# EAGLE design Comportamiento central (EAGLE 9.6.2)
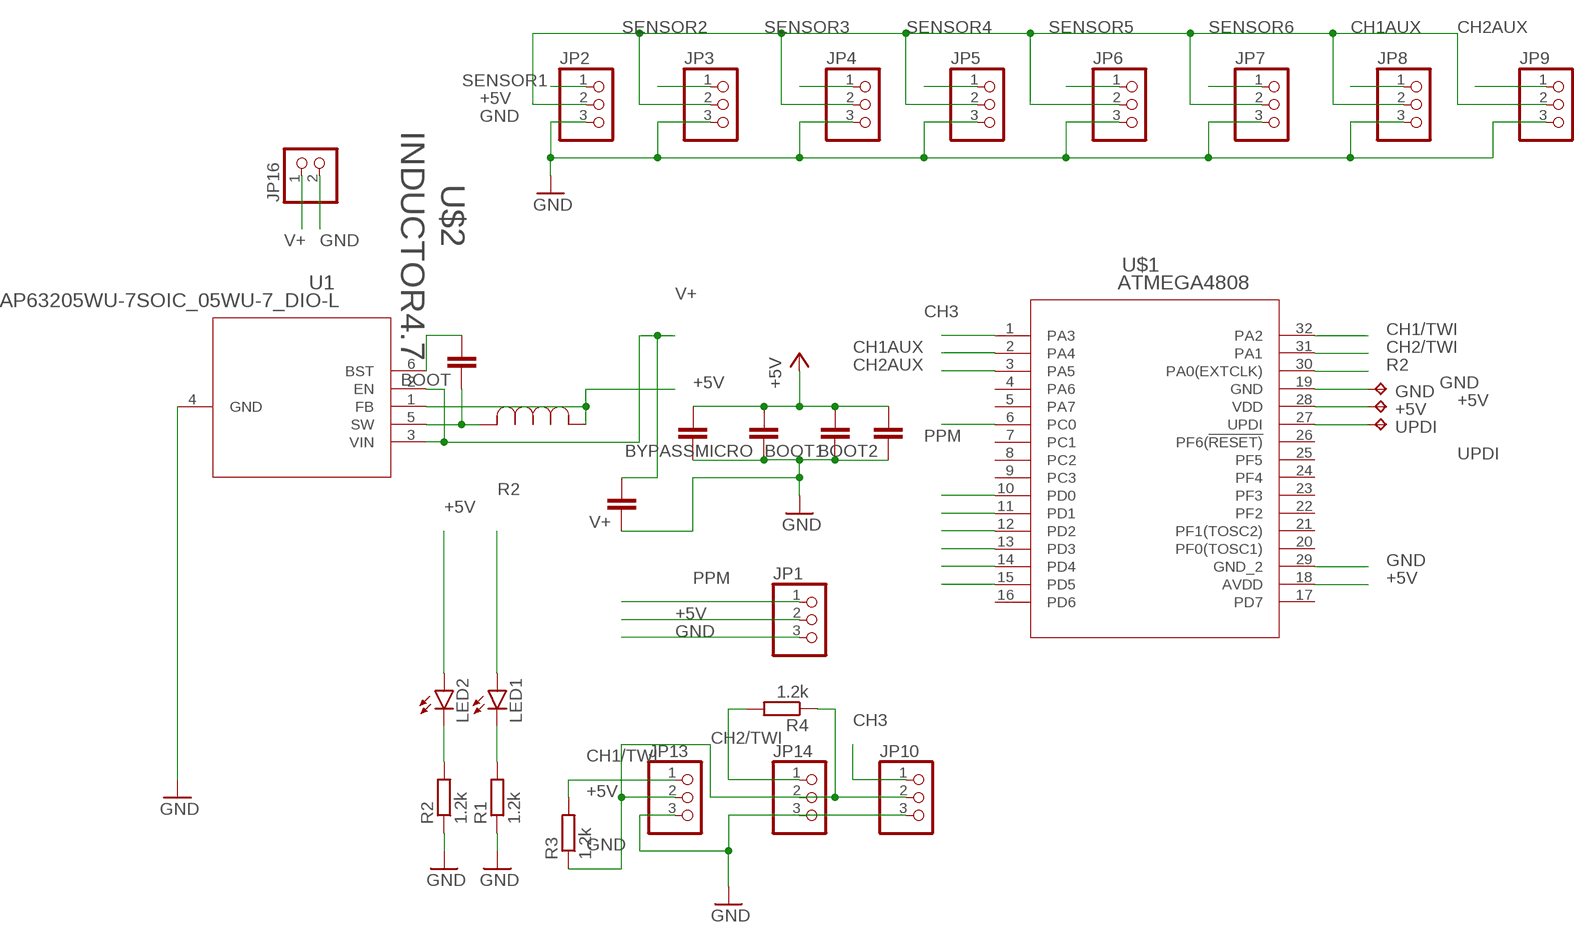
[diagram p0: schematic, sheet 1]

## Parts
+5V  TPB1,27  [B1,27]
BOOT  C-EUC0402  [C0402]
BOOT1  C-EUC0402  [C0402]
BOOT2  C-EUC0402  [C0402]
BYPASSMICRO  C-EUC0603  [C0603]
BYPASSMICRO2  C-EUC0603  [C0603]
GND  TPB1,27  [B1,27]
JP1  PINHD-1X03_2.54-S  [1X03-S]
JP2  PINHD-1X03_2.54-S  [1X03-S]
JP3  PINHD-1X03_2.54-S  [1X03-S]
JP4  PINHD-1X03_2.54-S  [1X03-S]
JP5  PINHD-1X03_2.54-S  [1X03-S]
JP6  PINHD-1X03_2.54-S  [1X03-S]
JP7  PINHD-1X03_2.54-S  [1X03-S]
JP8  PINHD-1X03_2.54-S  [1X03-S]
JP9  PINHD-1X03_2.54-S  [1X03-S]
JP10  PINHD-1X03_2.54-S  [1X03-S]
JP13  PINHD-1X03_2.54-S  [1X03-S]
JP14  PINHD-1X03_2.54-S  [1X03-S]
JP16  PINHD-1X02_2.54-S  [1X02-S]
LED1  LEDCHIPLED_0603  [CHIPLED_0603]
LED2  LEDCHIPLED_0603  [CHIPLED_0603]
R1  1.2k  R-EU_R0603  [R0603]
R2  1.2k  R-EU_R0603  [R0603]
R3  1.2k  R-EU_R0603  [R0603]
R4  1.2k  R-EU_R0603  [R0603]
U1  AP63205WU-7SOIC_05WU-7_DIO-L  [SOIC_05WU-7_DIO-L]
U$1  ATMEGA4808  [QFP80P900X900X120-32N]
U$2  INDUCTOR4.7  [IND_NRS5030T100MMGJ_TAY]
UPDI  TPB1,27  [B1,27]
V+  C-EUC1206  [C1206]

## Nets
+5V: +5V.TP BOOT1.2 BOOT2.2 BYPASSMICRO2.2 BYPASSMICRO.2 JP1.2 JP2.2 JP3.2 JP4.2 JP5.2 JP6.2 JP7.2 JP8.2 JP9.2 JP10.2 JP13.2 JP14.2 LED2.A R3.1 R4.1 U1.1(FB) U$1.18(AVDD) U$1.28(VDD) U$2.1
CH1/TWI: JP13.1 R3.2 U$1.32(PA2)
CH1AUX: JP8.1 U$1.2(PA4)
CH2/TWI: JP14.1 R4.2 U$1.31(PA1)
CH2AUX: JP9.1 U$1.3(PA5)
CH3: JP10.1 U$1.1(PA3)
GND: BOOT1.1 BOOT2.1 BYPASSMICRO2.1 BYPASSMICRO.1 GND.TP JP1.3 JP2.3 JP3.3 JP4.3 JP5.3 JP6.3 JP7.3 JP8.3 JP9.3 JP10.3 JP13.3 JP14.3 JP16.2 R1.1 R2.1 U1.4(GND) U$1.19(GND) U$1.29(GND_2) V+.1
N$2: LED2.C R2.2
N$15: LED1.C R1.2
N$17: BOOT.1 U1.5(SW) U$2.2
N$18: BOOT.2 U1.6(BST)
PPM: JP1.1 U$1.6(PC0)
R2: LED1.A U$1.30(PA0(EXTCLK))
SENSOR1: JP2.1 U$1.10(PD0)
SENSOR2: JP3.1 U$1.11(PD1)
SENSOR3: JP4.1 U$1.12(PD2)
SENSOR4: JP5.1 U$1.13(PD3)
SENSOR5: JP6.1 U$1.14(PD4)
SENSOR6: JP7.1 U$1.15(PD5)
UPDI: U$1.27(UPDI) UPDI.TP
V+: JP16.1 U1.2(EN) U1.3(VIN) V+.2
Unconnected: U$1.4(PA6) U$1.5(PA7) U$1.7(PC1) U$1.8(PC2) U$1.9(PC3) U$1.16(PD6) U$1.17(PD7) U$1.20(PF0(TOSC1)) U$1.21(PF1(TOSC2)) U$1.22(PF2) U$1.23(PF3) U$1.24(PF4) U$1.25(PF5) U$1.26(PF6(!RESET))

## Library data of the parts
+5V GND UPDI = testpad:TP: Test pad
BOOT BOOT1 BOOT2 BYPASSMICRO BYPASSMICRO2 V+ = rcl:C-EU: CAPACITOR, European symbol; SPICEPREFIX: C
JP1-JP10 JP13 JP14 = pinhead-2:PINHD-1X03: PIN HEADER
JP16 = pinhead-2:PINHD-1X02: PIN HEADER
LED1 LED2 = led:LED: LED OSRAM: - CHIPLED LG R971, LG N971, LY N971, LG Q971, LY Q971, LO R971, LY R971 LH N974, LH R974 LS Q976, LO Q976, LY Q976 LO Q996 - Hyper CHIPLED LW Q18S LB Q993, LB Q99A, LB R99A - SideLED LS A670, LO A670, LY A670, LG A670, LP A670 LB A673, LV A673, LT A673, LW A673 LH A674 LY A675 LS A676, LA A676, LO A676, LY A676, LW A676 LS A679, LY A679, LG A679 - Hyper Micro SIDELED® LS Y876, LA Y876, LO Y876, LY Y876 LT Y87S - SmartLED LW L88C, LW L88S LB L89C, LB L89S, LG L890 LS L89K, LO L89K, LY L89K LS L896, LA L896, LO L896, LY L896 - TOPLED LS T670, LO T670, LY T670, LG T670, LP T670 LSG T670, LSP T670, LSY T670, LOP T670, LYG T670 LG T671, LOG T671, LSG T671 LB T673, LV T673, LT T673, LW T673 LH T674 LS T676, LA T676, LO T676, LY T676, LB T676, LH T676, LSB T676, LW T676 LB T67C, LV T67C, LT T67C, LS T67K, LO T67K, LY T67K, LW E67C LS E67B, LA E67B, LO E67B, LY E67B, LB E67C, LV E67C, LT E67C LW T67C LS T679, LY T679, LG T679 LS T770, LO T770, LY T770, LG T770, LP T770 LB T773, LV T773, LT T773, LW T773 LH T774 LS E675, LA E675, LY E675, LS T675 LS T776, LA T776, LO T776, LY T776, LB T776 LHGB T686 LT T68C, LB T68C - Hyper Mini TOPLED® LB M676 - Mini TOPLED Santana® LG M470 LS M47K, LO M47K, LY M47K Source: http://www.osram.convergy.de LUXEON: - LUMILED® LXK2-PW12-R00, LXK2-PW12-S00, LXK2-PW14-U00, LXK2-PW14-V00 LXK2-PM12-R00, LXK2-PM12-S00, LXK2-PM14-U00 LXK2-PE12-Q00, LXK2-PE12-R00, LXK2-PE12-S00, LXK2-PE14-T00, LXK2-PE14-U00 LXK2-PB12-K00, LXK2-PB12-L00, LXK2-PB12-M00, LXK2-PB14-N00, LXK2-PB14-P00, LXK2-PB14-Q00 LXK2-PR12-L00, LXK2-PR12-M00, LXK2-PR14-Q00, LXK2-PR14-R00 LXK2-PD12-Q00, LXK2-PD12-R00, LXK2-PD12-S00 LXK2-PH12-R00, LXK2-PH12-S00 LXK2-PL12-P00, LXK2-PL12-Q00, LXK2-PL12-R00 Source: www.luxeon.com KINGBRIGHT: KA-3528ASYC Source: www.kingbright.com
R1-R4 = rcl:R-EU_: RESISTOR, European symbol; SPICEPREFIX: R
U1 = AP63205WU-7:AP63205WU-7; BUILT_BY: EMA_Matt; COPYRIGHT: Copyright (C) 2018 Accelerated Designs. All rights reserved; MANUFACTURER_PART_NUMBER: AP63205WU-7; SOURCELIBRARY: Diodes_Inc_2019-12-05; VENDOR: Diodes Inc
U$1 = Atmega4808:ATMEGA4808
U$2 = Inductor4.7:INDUCTOR4.7

## Board
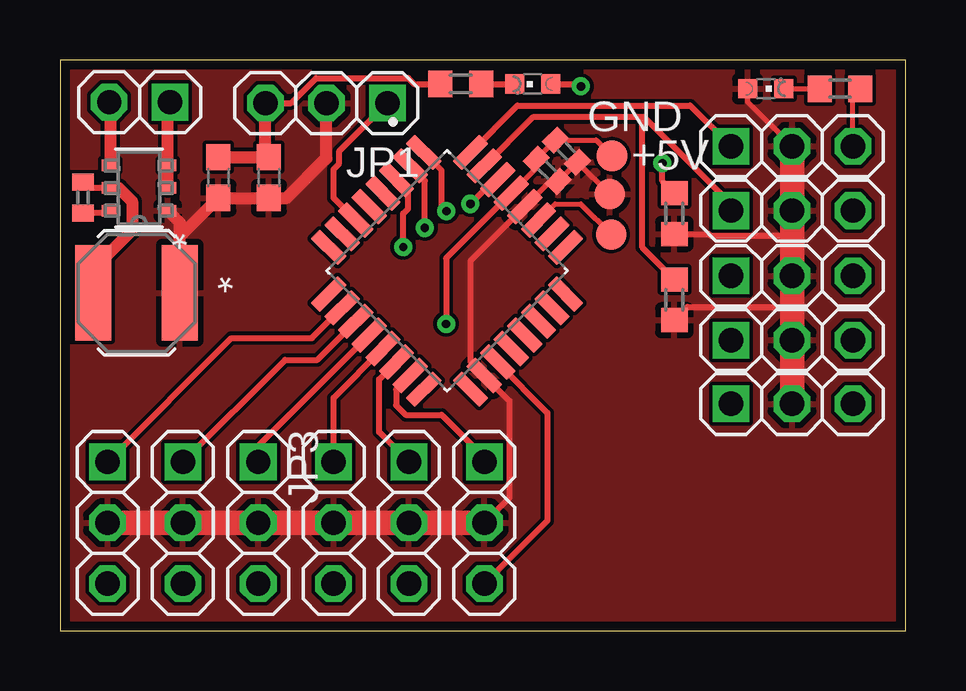
[diagram p1: board, top side]
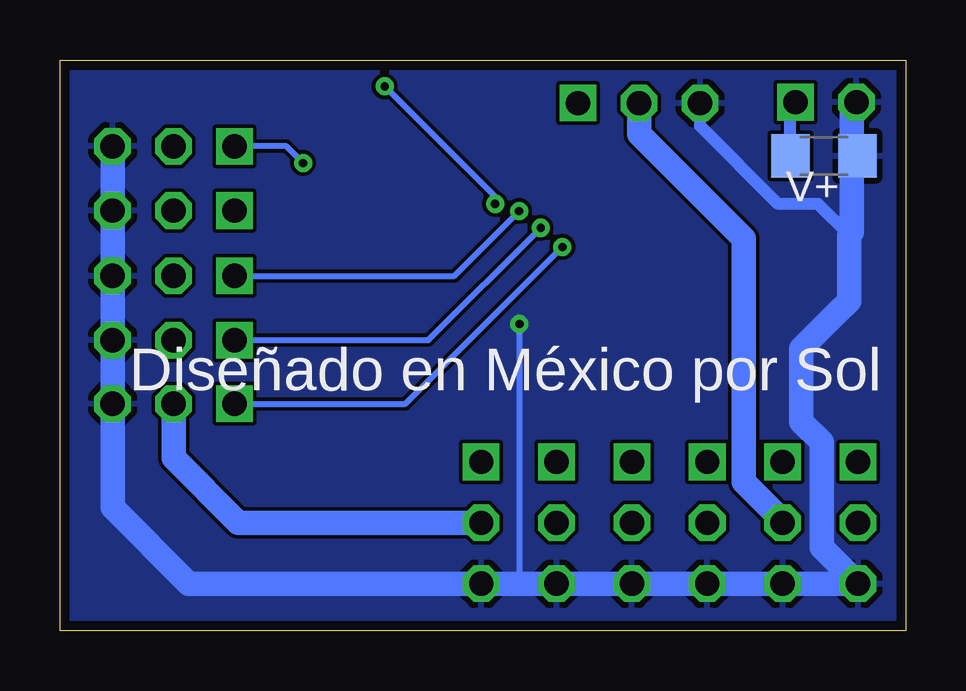
[diagram p2: board, bottom side, seen from below]

Size 35.23 x 23.8 mm. Coordinates in mm from the lower left corner, seen from the top.
Outline: 0,0 35.23,0 35.23,23.8 0,23.8 0,0
Copper layers (1*16): Top 0.035mm / dielectric 1.5mm / Bottom 0.035mm
Design rules "default *": minimum track width 6mil, minimum drill 0.35mm, track to track 6mil, track to pad 6mil, pad to pad 6mil, via to via 6mil, smd to smd 6mil, copper to edge 0.4mm, drill to drill 10mil, minimum pad ring 10mil, minimum via ring 8mil, stop-mask expansion 4mil, vias tented up to drill 0mil, thermal gap 10mil

### Footprints (pad centres in the part's own frame; a part is rotated, then mirrored left to right if it is on the bottom)
B1,27 = smd 1.27 x 1.27: TP 0,0
C0402 = smd 0.7 x 0.9: 1 -0.65,0; 2 0.65,0
C0603 = smd 1.1 x 1: 1 -0.85,0; 2 0.85,0
1X03-S = drill 1.016 square: 1 -2.54,0 | drill 1.016 octagon: 2 0,0; 3 2.54,0
1X02-S = drill 1.016 square: 1 -1.27,0 | drill 1.016 octagon: 2 1.27,0
CHIPLED_0603 = smd 0.8 x 0.8: A 0,-0.75; C 0,0.75
R0603 = smd 1 x 1.1: 1 -0.85,0; 2 0.85,0
SOIC_05WU-7_DIO-L = smd 0.696 x 0.477: 1 -1.199,0.95; 2 -1.199,0; 3 -1.199,-0.95; 4 1.199,-0.95; 5 1.199,0; 6 1.199,0.95
QFP80P900X900X120-32N = smd 1.6 x 0.55: 1 -4.18,2.8; 2 -4.18,2; 3 -4.18,1.2; 4 -4.18,0.4; 5 -4.18,-0.4; 6 -4.18,-1.2; 7 -4.18,-2; 8 -4.18,-2.8; 17 4.18,-2.8; 18 4.18,-2; 19 4.18,-1.2; 20 4.18,-0.4; 21 4.18,0.4; 22 4.18,1.2; 23 4.18,2; 24 4.18,2.8 | smd 0.55 x 1.6: 9 -2.8,-4.18; 10 -2,-4.18; 11 -1.2,-4.18; 12 -0.4,-4.18; 13 0.4,-4.18; 14 1.2,-4.18; 15 2,-4.18; 16 2.8,-4.18; 25 2.8,4.18; 26 2,4.18; 27 1.2,4.18; 28 0.4,4.18; 29 -0.4,4.18; 30 -1.2,4.18; 31 -2,4.18; 32 -2.8,4.18
IND_NRS5030T100MMGJ_TAY = smd 1.499 x 3.988: 1 -1.8,0; 2 1.8,0
C1206 = smd 1.6 x 1.8: 1 -1.4,0; 2 1.4,0

### Placement (x,y rotation side)
+5V  22.9,18.2 180 top
BOOT  0.96,18.06 270 top
BOOT1  21.1,20 315 top
BOOT2  20.3,19.2 315 top
BYPASSMICRO  8.7,18.9 270 top
BYPASSMICRO2  6.6,18.9 270 top
GND  23,19.8 0 top
JP1  11.1,22 180 top
JP2  1.98,4.5 270 top
JP3  5.12,4.5 270 top
JP4  8.26,4.5 270 top
JP5  11.4,4.5 270 top
JP6  14.54,4.5 270 top
JP7  17.68,4.5 270 top
JP8  30.5,12.12 0 top
JP9  30.5,9.46 0 top
JP10  30.5,14.8 0 top
JP13  30.5,20.2 0 top
JP14  30.5,17.52 0 top
JP16  3.32,22.04 180 top
LED1  19.7,22.8 90 top
LED2  29.4,22.6 270 top
R1  16.7,22.8 0 top
R2  32.5,22.6 180 top
R3  25.6,17.4 90 top
R4  25.6,13.8 90 top
U1  3.29,18.46 180 top
U$1  16.13,15.01 315 top
U$2  3.19,14.09 180 top
UPDI  22.96,16.52 0 top
V+  3.4,19.8 180 bottom

### Tracks (layer width: path | path; a pad name or v marks a point on that pad's centre or on a via)
+5V
  Top 0.2: JP13.2 28.65,22.05 LED2.A | U$1.28 20.43,18.74 BOOT2.2 BOOT1.2 +5V.TP | +5V.TP
  Top 0.254: U$1.28 17.1,15.41 17.1,11.21 U$1.18 18.72,9.59 18.72,5.54 JP7.2 | R4.1 26.15,13.5 30.5,13.5 | R3.1 27.01,16.55 27.08,16.48 30.12,16.48 30.5,16.1
  Top 0.508: U1.1 4.99,17.01 U$2.1 4.99,16.44 BYPASSMICRO2.2 BYPASSMICRO.2 9.45,18.05 11.1,19.7 JP1.2
  Top 1.016: JP2.2 JP3.2 JP4.2 JP5.2 JP6.2 JP7.2 | JP9.2 JP8.2 30.5,13.5 JP10.2 30.5,16.1 JP14.2 JP13.2 30.55,20.25
  Bottom 0.508: JP1.2 11.1,21.84
  Bottom 1.016: JP1.2 11.1,20.7 6.74,16.34 6.74,6.2 5.12,4.58 JP3.2 | JP7.2 27.8,4.5 30.5,7.2 JP9.2
  pour Top: 0,0 0,23.8 35.2,23.8 35.2,0
CH1/TWI  (via drill 0.35)
  Top 0.254: JP13.1 26.26,21.9 19.06,21.9 U$1.32 | R3.2 25.1,18.75 v25.1,19.5
  Bottom 0.254: v25.1,19.5 25.8,20.2 JP13.1
CH1AUX  (via drill 0.35)
  Top 0.254: U$1.2 15.2,18.77 v15.2,16.8
  Bottom 0.254: JP8.1 19.88,12.12 v15.2,16.8
CH2/TWI
  Top 0.254: 24.27,21.41 19.7,21.41 U$1.31 | JP14.1 27.96,17.78 24.34,21.41 24.27,21.41 | 24.27,21.41 24.27,15.98 R4.2
CH2AUX  (via drill 0.35)
  Top 0.254: v14.3,16 14.3,17.4 14.5,17.6 14.5,18.34 U$1.3
  Bottom 0.254: JP9.1 20.84,9.46 v14.3,16
CH3  (via drill 0.35)
  Top 0.254: v16.1,17.5 15.9,17.7 15.9,19.2 U$1.1
  Bottom 0.254: JP10.1 18.8,14.8 v16.1,17.5
GND  (via drill 0.35)
  Top 0.2: JP13.3 33.04,22.29 R2.1 | U$1.29 19.84,19.29 BOOT2.1 BOOT1.1 22.34,20.46 GND.TP
  Top 0.254: U$1.19 18.24,11.16 20.31,9.09 20.31,4.59 JP7.3 | JP1.3 9.63,22 10.67,23.04 14.52,23.04 14.76,22.8 R1.1 | U$1.29 16.09,15.54 v16.09,12.79
  Top 0.508: JP16.2 2.09,22 U1.4 | BYPASSMICRO2.1 BYPASSMICRO.1 8.56,19.89 JP1.3
  Bottom 0.254: v16.09,12.79 16.09,1.97 16.1,1.96 | V+.1 2.25,19.8
  Bottom 0.508: 2.25,16.6 2.35,16.5 3.65,17.8 5.3,17.8 8.56,21.06 JP1.3 | 2.75,13.2 2.9,13.2 | JP16.2 2.49,22.04
  Bottom 1.016: JP16.2 2.25,21.84 2.25,19.8 2.25,16.6 | 2.35,16.5 2.35,13.75 2.9,13.2 4.34,11.76 4.34,8.72 3.5,7.88 3.5,3.48 JP2.3 JP3.3 JP4.3 JP5.3 JP6.3 16.1,1.96 JP7.3 29.86,1.96 33.04,5.14 JP9.3 JP8.3 JP10.3 JP14.3 JP13.3 33.22,20.38
  pour Bottom: 0,0 0,23.8 35.2,23.8 35.2,0
N$2
  Top 0.2: LED2.C R2.2
N$15
  Top 0.254: R1.2 LED1.C
N$17
  Top 0.254: U1.5 1.21,18.46 BOOT.1
  Top 0.508: U1.5 2.44,18.46 3,17.9 3,16.7 1.39,15.09 U$2.2
N$18
  Top 0.254: U1.6 1.99,17.41 BOOT.2
PPM
  Top 0.254: U$1.6 11.4,18.04 11.4,19.25 11.63,19.48 11.63,19.99 JP1.1
R2  (via drill 0.35)
  Top 0.254: v17.1,17.8 18.11,18.81 U$1.30 | LED1.A 21.6,22.8 v21.7,22.7
  Bottom 0.254: v21.7,22.7 17.1,18.1 v17.1,17.8
SENSOR1
  Top 0.254: JP2.1 7.14,12.2 10.49,12.2 U$1.10
SENSOR2
  Top 0.254: JP3.1 9.38,11.3 10.72,11.3 U$1.11
SENSOR3
  Top 0.254: JP4.1 8.26,7.71 U$1.12
SENSOR4
  Top 0.254: JP5.1 11.4,9.71 U$1.13
SENSOR5
  Top 0.254: JP6.1 13.3,8.28 13.3,10.48 U$1.14
SENSOR6
  Top 0.254: U$1.15 14,10.05 14,9.4 14.4,9 15.9,9 17.68,7.22 JP7.1
UPDI
  Top 0.2: U$1.27 20.62,17.8 21.7,17.8 22.96,16.54 UPDI.TP
V+
  Top 0.508: U1.2 U1.3 4.49,21.94 JP16.1
  Bottom 0.508: V+.2 4.8,21.83 JP16.1

### Text on the board
bNames: Diseñado en México por Sol